# EasyEDA Pro project BCD_Source.epro

# Schematic Schematic1
Board Name: Board1; Create Date: 2026-05-20; Page Name: P1; Project Name: pcbwatch; Schematic Name: Schematic1; Update Date: 2026-05-27; Company: EasyEDA.com; Page Size: A4; Version: V1.0
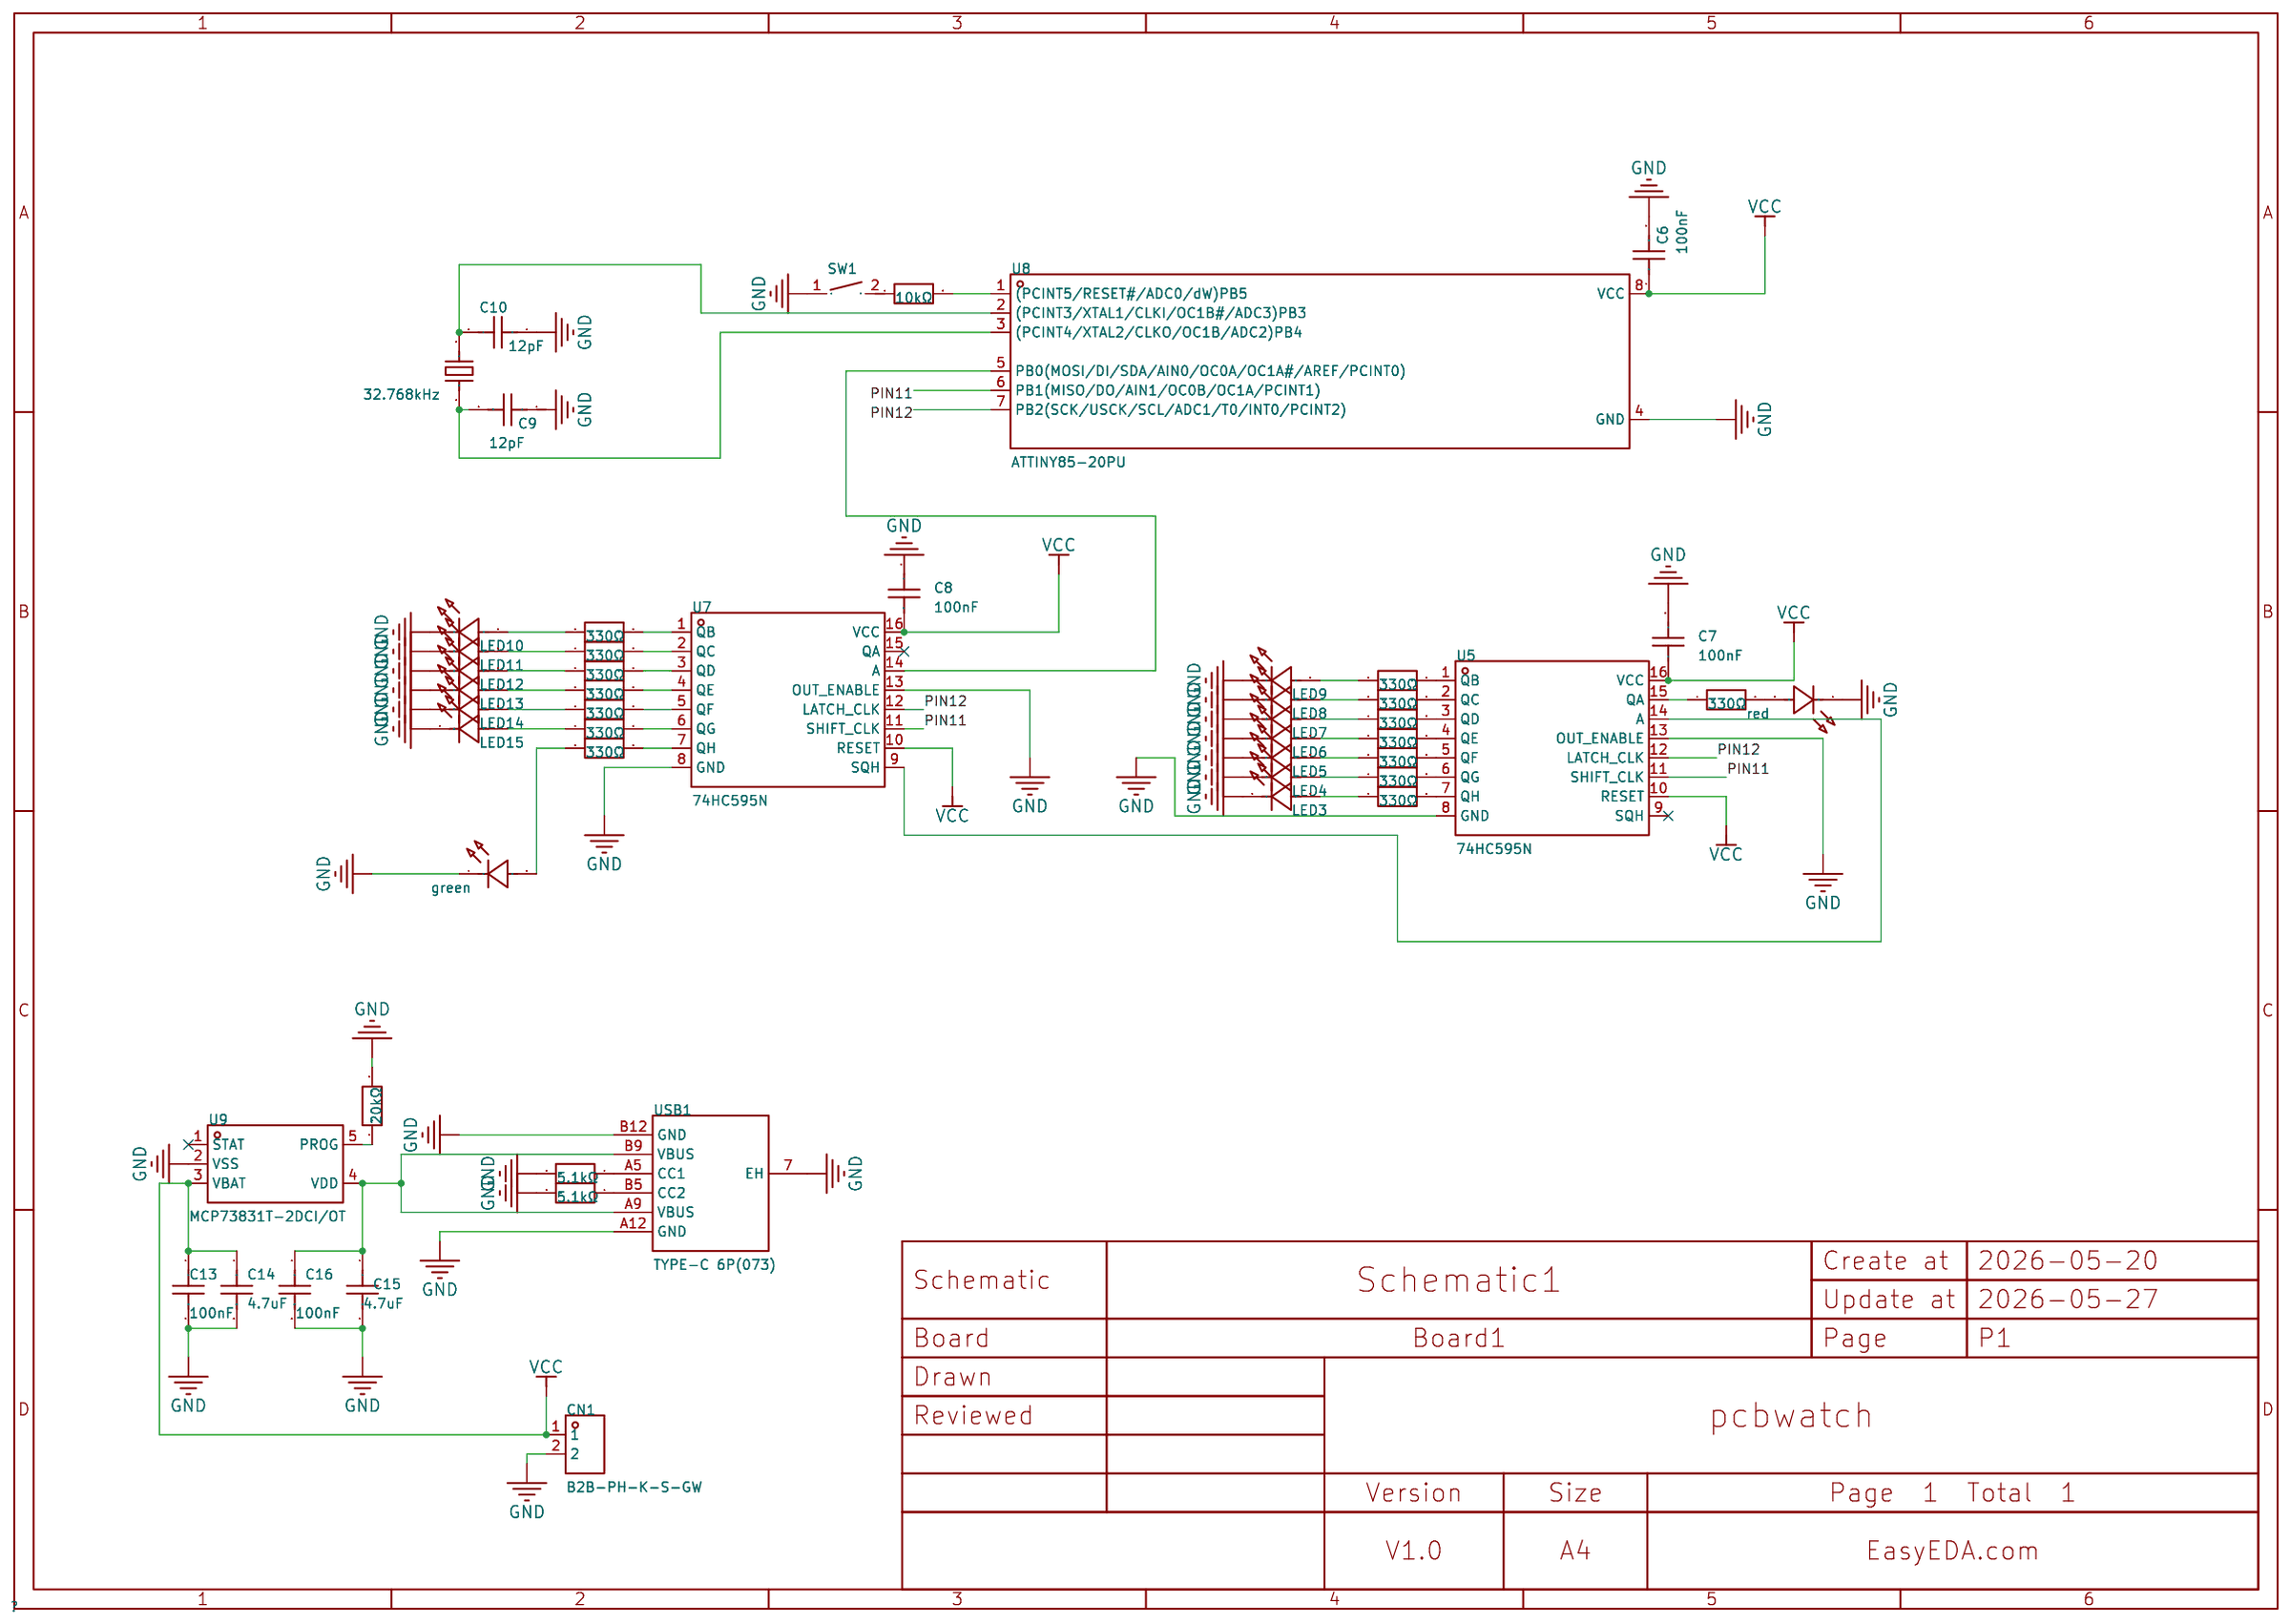
[diagram p0: schematic sheet]

## Parts
C6  100nF  [CAP-TH_L5.8-W2.4-P2.54-D0.6]
C7  100nF  [CAP-TH_L5.8-W2.4-P2.54-D0.6]
C8  100nF  [CAP-TH_L5.8-W2.4-P2.54-D0.6]
C9  12pF  [CAP-TH_L5.8-W2.4-P2.54-D0.6]
C10  12pF  [CAP-TH_L5.8-W2.4-P2.54-D0.6]
C13  100nF  [CAP-TH_L5.8-W2.4-P2.54-D0.6]
C14  4.7uF  [CAP-TH_L5.8-W2.4-P2.54-D0.6]
C15  4.7uF  [CAP-TH_L5.8-W2.4-P2.54-D0.6]
C16  100nF  [CAP-TH_L5.8-W2.4-P2.54-D0.6]
CN1  B2B-PH-K-S-GW  [CONN-TH_B2B-PH-K-S]
green  TJ-S2012EX8T5ALC2R-A5  [LED0805-RD]
LED3  TJ-S2012EX8T5ALC2R-A5  [LED0805-RD]
LED4  TJ-S2012EX8T5ALC2R-A5  [LED0805-RD]
LED5  TJ-S2012EX8T5ALC2R-A5  [LED0805-RD]
LED6  TJ-S2012EX8T5ALC2R-A5  [LED0805-RD]
LED7  TJ-S2012EX8T5ALC2R-A5  [LED0805-RD]
LED8  TJ-S2012EX8T5ALC2R-A5  [LED0805-RD]
LED9  TJ-S2012EX8T5ALC2R-A5  [LED0805-RD]
LED10  TJ-S2012EX8T5ALC2R-A5  [LED0805-RD]
LED11  TJ-S2012EX8T5ALC2R-A5  [LED0805-RD]
LED12  TJ-S2012EX8T5ALC2R-A5  [LED0805-RD]
LED13  TJ-S2012EX8T5ALC2R-A5  [LED0805-RD]
LED14  TJ-S2012EX8T5ALC2R-A5  [LED0805-RD]
LED15  TJ-S2012EX8T5ALC2R-A5  [LED0805-RD]
R20  330Ω  [RES-TH_BD2.3-L6.5-P10.50-D0.5]
R21  330Ω  [RES-TH_BD2.3-L6.5-P10.50-D0.5]
R22  330Ω  [RES-TH_BD2.3-L6.5-P10.50-D0.5]
R23  330Ω  [RES-TH_BD2.3-L6.5-P10.50-D0.5]
R24  330Ω  [RES-TH_BD2.3-L6.5-P10.50-D0.5]
R25  330Ω  [RES-TH_BD2.3-L6.5-P10.50-D0.5]
R26  330Ω  [RES-TH_BD2.3-L6.5-P10.50-D0.5]
R27  330Ω  [RES-TH_BD2.3-L6.5-P10.50-D0.5]
R28  330Ω  [RES-TH_BD2.3-L6.5-P10.50-D0.5]
R29  330Ω  [RES-TH_BD2.3-L6.5-P10.50-D0.5]
R30  330Ω  [RES-TH_BD2.3-L6.5-P10.50-D0.5]
R31  330Ω  [RES-TH_BD2.3-L6.5-P10.50-D0.5]
R32  330Ω  [RES-TH_BD2.3-L6.5-P10.50-D0.5]
R33  330Ω  [RES-TH_BD2.3-L6.5-P10.50-D0.5]
R34  330Ω  [RES-TH_BD2.3-L6.5-P10.50-D0.5]
R36  10kΩ  [RES-TH_BD2.3-L6.5-P10.50-D0.5]
R40  20kΩ  [RES-TH_BD2.3-L6.5-P10.50-D0.5]
R41  5.1kΩ  [RES-TH_BD2.3-L6.5-P10.50-D0.5]
R42  5.1kΩ  [RES-TH_BD2.3-L6.5-P10.50-D0.5]
red  TJ-S2012EX8T5ALC2R-A5  [LED0805-RD]
SW1  HX 3x4x2-2P-1.6N TACTILE SWITCH  [KEY-SMD_L4.0-W3.0-LS4.9-1]
U5  74HC595N  [DIP-16_L19.8-W6.5-P2.54-LS7.6-BL]
U7  74HC595N  [DIP-16_L19.8-W6.5-P2.54-LS7.6-BL]
U8  ATTINY85-20PU  [PDIP-8_L9.3-W6.4-P2.54-LS7.9-BL-1]
U9  MCP73831T-2DCI/OT  [SOT-23-5_L2.9-W1.6-P0.95-LS2.8-BL]
USB1  TYPE-C 6P(073)  [TYPE-C-SMD_TYPE-C-6P-073]
X1  32.768kHz  [OSC-TH_BD2.0-P0.70-D0.3]

## Library data of the parts
C6-C10 C13-C16 = CC1H104ZA1ED3F5P1100: Capacitance:100nF Tolerance:-20%~+80% Tolerance:-20%~+80% Voltage Rating:50V Pin Spacing:2.54mm Temperature Coefficient:Y5V Diameter:5.8mm Body Thickness:2.4mm; LCSC Part Name: 100nF -20%~+80% 50V; Supplier Part: C2832506; Manufacturer: Dersonic(德尔创); Supplier Footprint: 插件,P=2.54mm; JLCPCB Part Class: Extended Part; Datasheet: https://item.szlcsc.com/datasheet/CC1H104ZA1ED3F5P1100/2990644.html; Supplier: LCSC; Tolerance: -20%~+80%; Voltage Rating: 50V; Pin Spacing: 2.54mm; Temperature Coefficient: Y5V; Diameter: 5.8mm; Body Thickness: 2.4mm
CN1 = B2B-PH-K-S-GW: Pins Structure:1x2P Pitch:2mm Mounting Type:Through Hole Reference Series:PH Number of Pins:2P Number of Rows:1 Number of PINs Per Row:2 Row Spacing:- Current Rating:2A Contact Material:Brass Contact Plating:Tin Operating Temperature:-25℃~+85℃ Operating T; LCSC Part Name: 1x2P 间距:2mm 直插 系列:PH; Supplier Part: C5251182; Manufacturer: JST; Supplier Footprint: 插件,P=2mm; JLCPCB Part Class: Extended Part; Datasheet: https://item.szlcsc.com/datasheet/B2B-PH-K-S-GW/5967705.html; Supplier: LCSC; Pins Structure: 1x2P; Pitch: 2mm; Mounting Type: Through Hole; Reference Series: PH; Number of Pins: 2P; Number of Rows: 1; Number of PINs Per Row: 2; Current Rating: 2A; Contact Material: Brass; Contact Plating: Tin; Operating Temperature: -25℃~+85℃; Voltage Rating: 100V; Plastic Material: PA66; Flame Retardant Rating: UL94V-0; Supplementary Features: K Pin; Color: White; Z-Height of the Board: 6mm; X-Length of Bottom Edge on Board (Spacing Line): 5.9mm; Y-Width of Bottom Edge on Board: 4.5mm
green LED3-LED15 red = TJ-S2012EX8T5ALC2R-A5: Lamp Holder Type:2mm x 1.25mm square LED Illumination Color:Red Voltage - Forward(Vf):1.8V~2.4V Voltage - Forward(Vf):1.8V~2.4V Power(Watts):48mW Forward Current:20mA Wavelength - Dominant:620nm~630nm Wavelength - Dominant:620nm~630nm Peak Wavelength:631n; LCSC Part Name: SMD0805灯珠红光; Supplier Part: C48689647; Manufacturer: TOGIALED(统佳); Supplier Footprint: 0805; JLCPCB Part Class: Extended Part; Datasheet: https://item.szlcsc.com/datasheet/TJ-S2012EX8T5ALC2R-A5/50980865.html; Supplier: LCSC; Lamp Holder Type: 2mm x 1.25mm square LED; Illumination Color: Red; Voltage - Forward(Vf): 1.8V~2.4V; Power(Watts): 48mW; Forward Current: 20mA; Wavelength - Dominant: 620nm~630nm; Peak Wavelength: 631nm; Diode Configuration: Discrete Diode; Lens Color: Water Clear; Luminous Intensity: 200mcd; Viewing Angle: 120°; Operating Temperature: -40℃~+80℃
R20-R34 R36 R40-R42 = MF1/4W-1KΩ±1%T52: Type:Metal Film Resistors Resistance: Tolerance:±1% Tolerance:±1% Power(Watts):250mW Temperature Coefficient:±200ppm/℃ Temperature Coefficient:±200ppm/℃; LCSC Part Name: 金属膜电阻 1kΩ ±1% 250mW; Supplier Part: C713997; Manufacturer: 华星机电; Supplier Footprint: 插件,D2.3xL6.5mm; JLCPCB Part Class: Extended Part; Datasheet: https://atta.szlcsc.com/upload/public/pdf/source/20200731/C713882_AE8EB1102749D7E4FB4FB13DC898C429.pdf; Supplier: LCSC; Type: Metal Film Resistors; Tolerance: ±1%; Power(Watts): 250mW; Temperature Coefficient: ±200ppm/℃
SW1 = HX 3x4x2-2P-1.6N TACTILE SWITCH: Circuit:SPST Actuator Style:Round Button Operating Force:1.6N Mounting Type:Surface Mount,Vertical Length:4mm Width:3mm Switch Height:2mm with Bracket:Without Bracket Contact Current:50mA Voltage Rating:12V Actuator/Cap Color:Black With Lamp:No IP Rating:; LCSC Part Name: 4*3*2mm 立贴 轻触开关; Supplier Part: C49234124; Manufacturer: hanxia(韩下); Supplier Footprint: SMD; JLCPCB Part Class: Extended Part; Datasheet: https://item.szlcsc.com/datasheet/HX%25203x4x2-2P-1.6N%2520TACTILE%2520SWITCH/51650185.html; Supplier: LCSC; Circuit: SPST; Actuator Style: Round Button; Operating Force: 1.6N; Mounting Type: Surface Mount,Vertical; Length: 4mm; Width: 3mm; Switch Height: 2mm; with Bracket: Without Bracket; Contact Current: 50mA; Voltage Rating: 12V; Actuator/Cap Color: Black; With Lamp: No; Termination Style: SMD(SMT) Tab; Life: 100,000 Cycles
U5 U7 = 74HC595N: Function:Serial-to-Serial or Parallel Voltage - Supply:2V~6V Voltage - Supply:2V~6V Clock Frequency:28MHz Number of Elements:1 Number of Bits per Element:8 Output Type:Tri-State Series:74HC Operating Temperature:-55℃~+125℃ Operating Temperature:-55℃~+125℃; LCSC Part Name: 停产 74HC595N; Supplier Part: C669328; Manufacturer: HTC; Supplier Footprint: DIP-16; JLCPCB Part Class: Extended Part; Datasheet: https://item.szlcsc.com/datasheet/74HC595N/699730.html; Supplier: LCSC; Function: Serial-to-Serial or Parallel; Voltage - Supply: 2V~6V; Clock Frequency: 28MHz; Number of Elements: 1; Number of Bits per Element: 8; Output Type: Tri-State; Series: 74HC; Operating Temperature: -55℃~+125℃
U8 = ATTINY85-20PU: CPU Core:AVR CPU Maximum Speed:20MHz Core Size:8 Bit Program Storage Size:8KB Program Memory Type:FLASH RAM Size:512Byte EEPROM:512Byte Number of I/O:6 ADC (Bit):10bit Oscillator Type:Built-in Voltage - Supply:2.7V~5.5V Voltage - Supply:2.7V~5.5V Operatin; Supplier Part: C965497; Manufacturer: MICROCHIP(美国微芯); Supplier Footprint: PDIP-8; JLCPCB Part Class: Extended Part; Datasheet: https://item.szlcsc.com/datasheet/ATTINY85-20PU/1052792.html; Supplier: LCSC; CPU Core: AVR; CPU Maximum Speed: 20MHz; Core Size: 8 Bit; Program Storage Size: 8KB; Program Memory Type: FLASH; RAM Size: 512Byte; EEPROM: 512Byte; Number of I/O: 6; ADC (Bit): 10bit; Oscillator Type: Built-in; Voltage - Supply: 2.7V~5.5V; Operating Temperature: -40℃~+85℃
U9 = MCP73831T-2DCI/OT: The Chip Type:Charging IC Voltage - Supply:3.75V~6V Voltage - Supply:3.75V~6V Charge Current - Max:550mA Charging Saturation Voltage:4.2V End-Off Voltage:- Type of Battery:Lithium Battery Number of Cells:1 Number of Cells:1 Operating Temperature:-40℃~+85℃; LCSC Part Name: 单节全集成锂离子/锂聚合物充电管理控制器; Supplier Part: C625597; Manufacturer: MICROCHIP(美国微芯); Supplier Footprint: SOT-23-5; JLCPCB Part Class: Extended Part; Datasheet: https://item.szlcsc.com/datasheet/MCP73831T-2DCI%252FOT/655504.html; Supplier: LCSC; The Chip Type: Charging IC; Voltage - Supply: 3.75V~6V; Charge Current - Max: 550mA; Charging Saturation Voltage: 4.2V; Type of Battery: Lithium Battery; Number of Cells: 1; Operating Temperature: -40℃~+85℃; Battery Temperature Detection: Not supported; Supply Current (Iq): 53uA
USB1 = TYPE-C 6P(073): Connector Type:Type-C Protocol Standard:- Gender:Female Mounting Type:Surface Mount, Right Angle Number of Contacts:6P Number of Ports:1 Current Rating-Power:3A Voltage Rating:5V Connect-Disconnect Life:10,000 Cycles Supplementary Features:- Center Height; LCSC Part Name: 6P卧贴母座; Supplier Part: C668623; Manufacturer: SHOU HAN(首韩); Supplier Footprint: SMD; JLCPCB Part Class: Extended Part; Datasheet: https://item.szlcsc.com/datasheet/TYPE-C%25206P(073)/698566.html; Supplier: LCSC; Connector Type: Type-C; Gender: Female; Mounting Type: Surface Mount, Right Angle; Number of Contacts: 6P; Number of Ports: 1; Current Rating-Power: 3A; Voltage Rating: 5V; Connect-Disconnect Life: 10,000 Cycles; Detection color: Black; Operating Temperature: -25℃~+85℃
X1 = TAXD32768K2BGBBZT2S: Type:Through Hole Crystal Oscillator Frequency:32.768kHz Normal temperature Frequency Tolerance:±10ppm Normal temperature Frequency Tolerance:±10ppm Load Capacitance:12.5pF Frequency Stability:±20ppm Frequency Stability:±20ppm Equivalent Series Resistance; LCSC Part Name: 32.768kHz ±10ppm 12.5pF; Supplier Part: C511702; Manufacturer: YJX(雅晶鑫); Supplier Footprint: DT-26; JLCPCB Part Class: Extended Part; Datasheet: https://item.szlcsc.com/datasheet/TAXD32768K2BGBBZT2S/526449.html; Supplier: LCSC; Type: Through Hole Crystal Oscillator; Normal temperature Frequency Tolerance: ±10ppm; Load Capacitance: 12.5pF; Frequency Stability: ±20ppm; Equivalent Series Resistance(ESR): 40kΩ; Operating Temperature: -20℃~+70℃

## Nets
GND: C6.2 C7.2 C8.1 C9.1 C10.1 C13.2 C14.2 C15.2 C16.2 CN1.2 green.1(C) LED3.1(C) LED4.1(C) LED5.1(C) LED6.1(C) LED7.1(C) LED8.1(C) LED9.1(C) LED10.1(C) LED11.1(C) LED12.1(C) LED13.1(C) LED14.1(C) LED15.1(C) R40.2 R41.2 R42.2 red.1(C) SW1.1 U5.8(GND) U5.13(OUT_ENABLE) U7.8(GND) U7.13(OUT_ENABLE) U8.4(GND) U9.2(VSS) USB1.7(EH) USB1.A12(GND) USB1.B12(GND)
VCC: C6.1 C7.1 C8.2 C13.1 C14.1 CN1.1 U5.10(RESET) U5.16(VCC) U7.10(RESET) U7.16(VCC) U8.8(VCC) U9.3(VBAT)
PIN11: U5.11(SHIFT_CLK) U7.11(SHIFT_CLK) U8.6(PB1(MISO/DO/AIN1/OC0B/OC1A/PCINT1))
PIN12: U5.12(LATCH_CLK) U7.12(LATCH_CLK) U8.7(PB2(SCK/USCK/SCL/ADC1/T0/INT0/PCINT2))
$1N1454: U7.14(A) U8.5(PB0(MOSI/DI/SDA/AIN0/OC0A/OC1A#/AREF/PCINT0))
$1N1740: U5.14(A) U7.9(SQH)
$1N15518: R40.1 U9.5(PROG)
Net-(C9-2): C9.2 U8.3((PCINT4/XTAL2/CLKO/OC1B/ADC2)PB4) X1.1
Net-(C10-2): C10.2 U8.2((PCINT3/XTAL1/CLKI/OC1B#/ADC3)PB3) X1.2
Net-(C15-1): C15.1 C16.1 U9.4(VDD) USB1.A9(VBUS) USB1.B9(VBUS)
Net-(green-2): green.2(A) R26.1
Net-(LED3-2): LED3.2(A) R33.1
Net-(LED4-2): LED4.2(A) R32.1
Net-(LED5-2): LED5.2(A) R31.1
Net-(LED6-2): LED6.2(A) R30.1
Net-(LED7-2): LED7.2(A) R29.1
Net-(LED8-2): LED8.2(A) R28.1
Net-(LED9-2): LED9.2(A) R27.1
Net-(LED10-2): LED10.2(A) R20.1
Net-(LED11-2): LED11.2(A) R21.1
Net-(LED12-2): LED12.2(A) R22.1
Net-(LED13-2): LED13.2(A) R23.1
Net-(LED14-2): LED14.2(A) R24.1
Net-(LED15-2): LED15.2(A) R25.1
Net-(R20-2): R20.2 U7.1(QB)
Net-(R21-2): R21.2 U7.2(QC)
Net-(R22-2): R22.2 U7.3(QD)
Net-(R23-2): R23.2 U7.4(QE)
Net-(R24-2): R24.2 U7.5(QF)
Net-(R25-2): R25.2 U7.6(QG)
Net-(R26-2): R26.2 U7.7(QH)
Net-(R27-2): R27.2 U5.1(QB)
Net-(R28-2): R28.2 U5.2(QC)
Net-(R29-2): R29.2 U5.3(QD)
Net-(R30-2): R30.2 U5.4(QE)
Net-(R31-2): R31.2 U5.5(QF)
Net-(R32-2): R32.2 U5.6(QG)
Net-(R33-2): R33.2 U5.7(QH)
Net-(R34-1): R34.1 U5.15(QA)
Net-(R34-2): R34.2 red.2(A)
Net-(R36-1): R36.1 SW1.2
Net-(R36-2): R36.2 U8.1((PCINT5/RESET#/ADC0/dW)PB5)
Net-(R41-1): R41.1 USB1.A5(CC1)
Net-(R42-1): R42.1 USB1.B5(CC2)

Not connected (* = marked no-connect by the designer): U5 9(SQH)*; U7 15(QA)*; U9 1(STAT)*

# Board PCB1
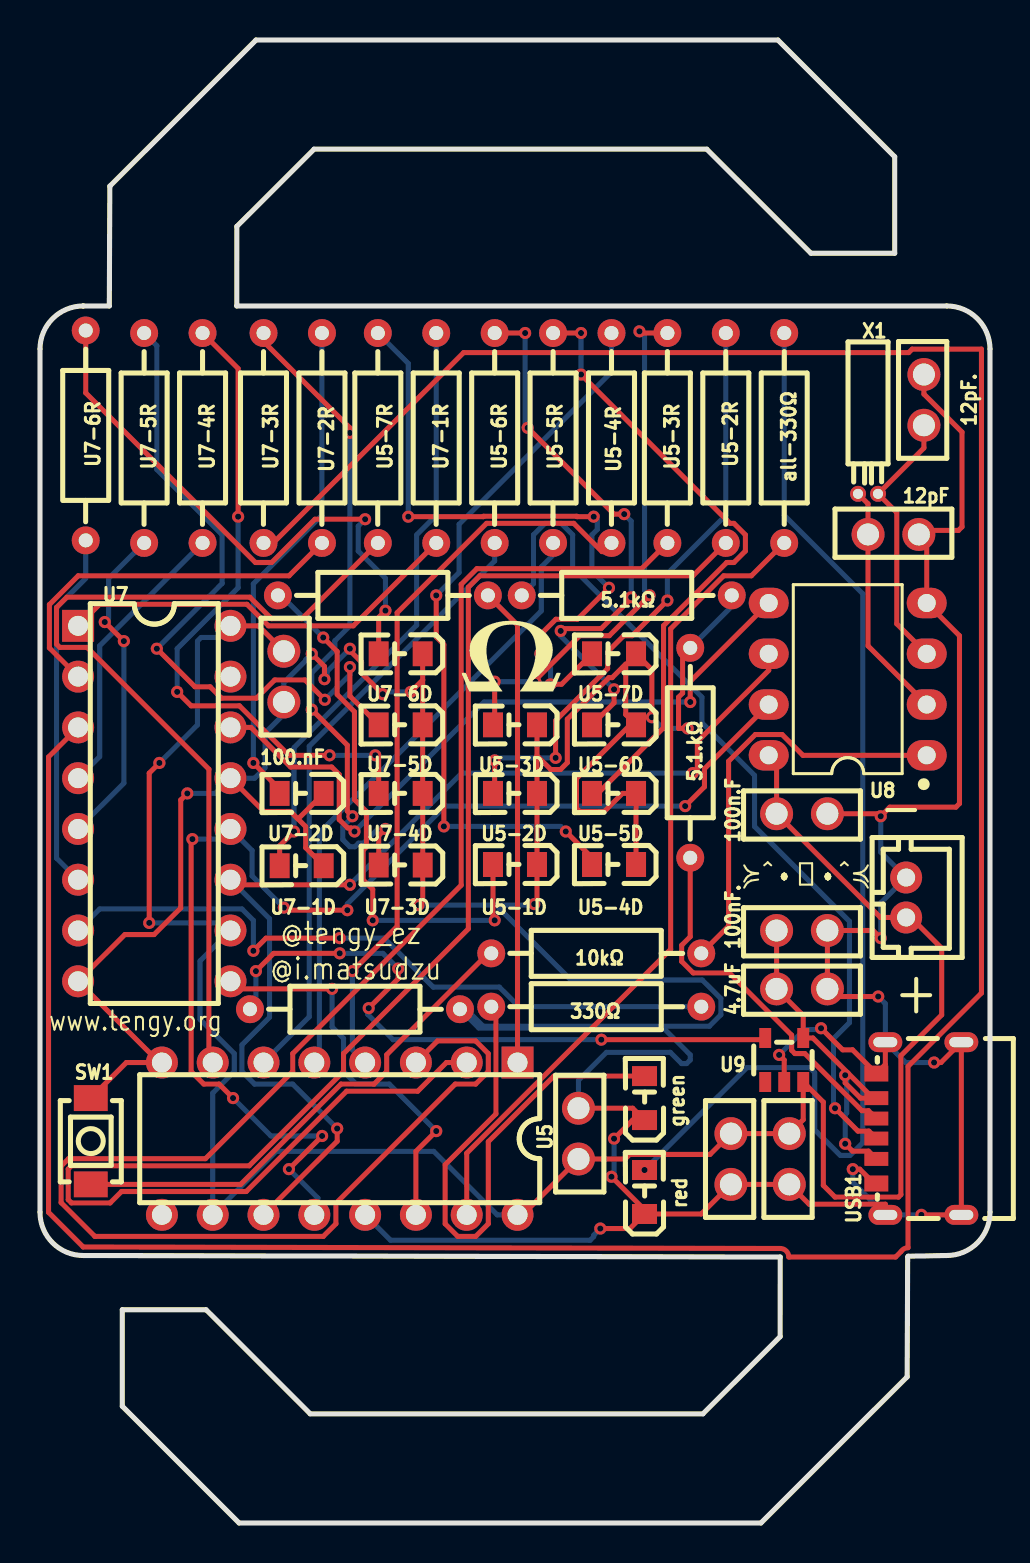
[diagram p1: board, top side]
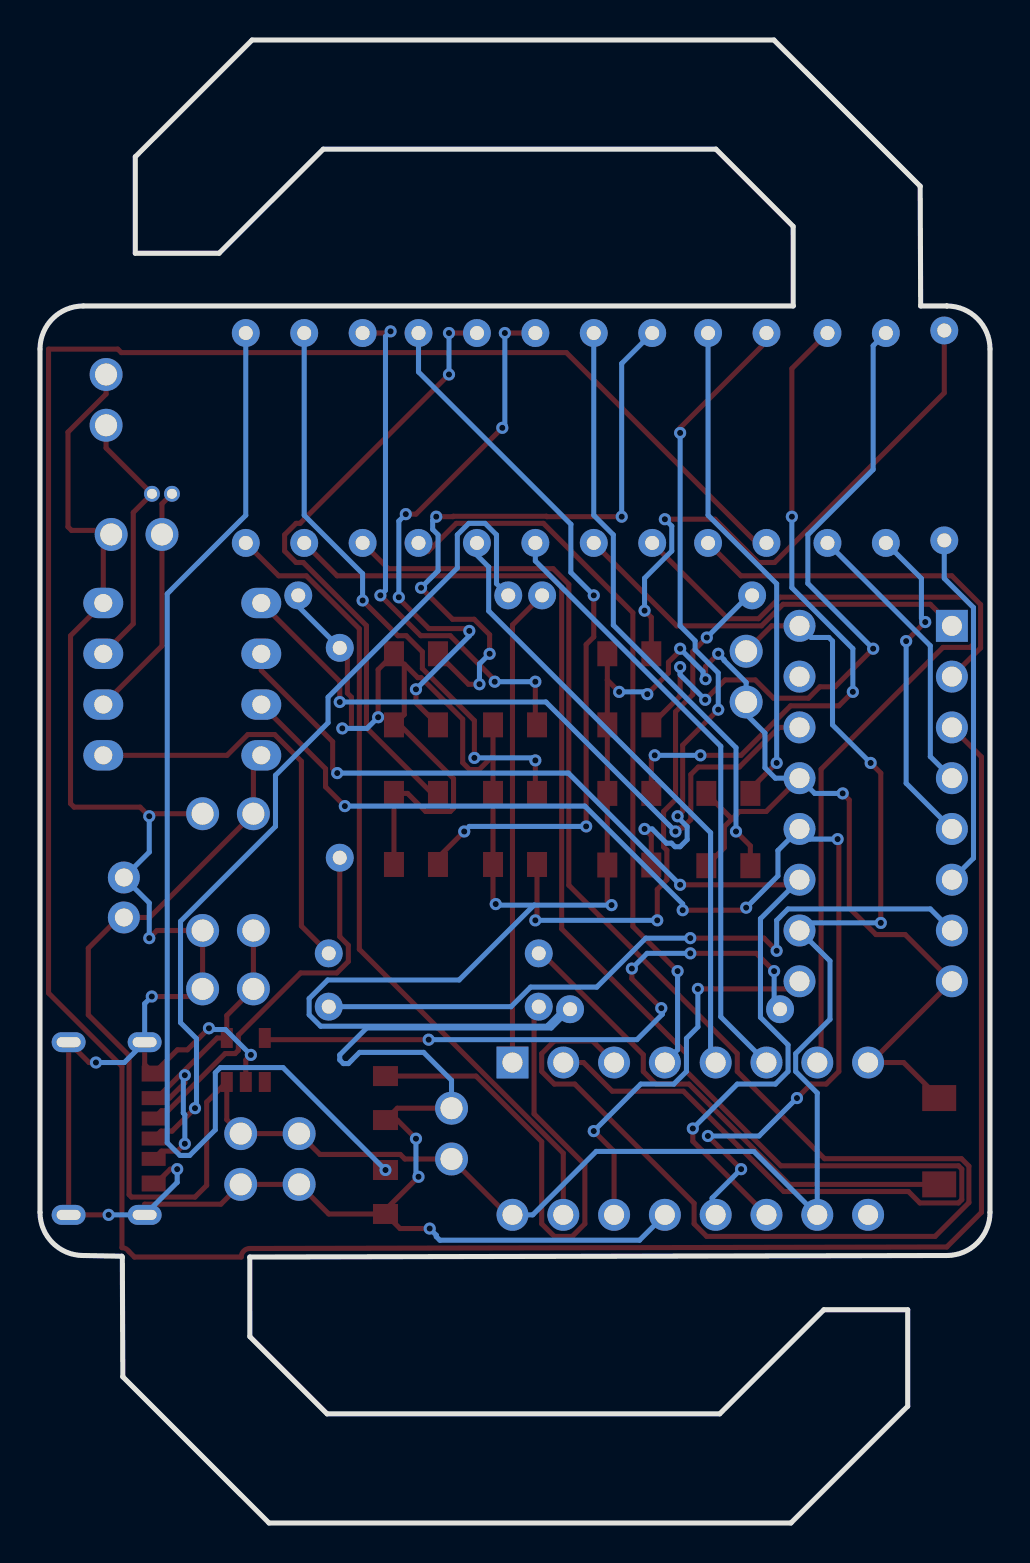
[diagram p2: board, bottom side, seen from below]

Outline 47.5 x 74.19 mm; copper layers: Top Layer, Bottom Layer. Coordinates in mm from the lower left corner of the outline.
Outline path: 0,58.72 arc(0.63,60.25) 2.16,60.88 2.15,60.88 3.47,60.88 3.49,66.87 10.8,74.19 36.89,74.19 42.73,68.35 42.73,63.52 38.54,63.52 33.34,68.73 13.71,68.73 9.84,64.86 9.84,60.88 45.34,60.88 arc(46.87,60.25) 47.5,58.72 47.5,15.54 arc(46.87,14.01) 45.34,13.38 43.41,13.35 43.38,13.31 43.36,7.31 36.05,0 9.96,0 4.11,5.84 4.11,10.67 8.31,10.67 13.51,5.46 33.14,5.46 37.01,9.33 37.01,13.31 2.16,13.38 arc(0.63,14.01) 0,15.54 0,58.72
Stack: Top Layer 0.035mm / Dielectric1 1.51mm FR4 er 4.5 / Bottom Layer 0.035mm

## Design rules (mm)
spacing copperThickness1oz (default): track to track 0.102, other pairs 0.152 to 0.3
spacing copperThickness2oz: track to track 0.203, other pairs 0.152 to 0.3
spacing Plane_innerPlane: track to track 0.102, other pairs 0.152 to 0.3
spacing Copper_copperRegion: track to track 0.102, other pairs 0.152 to 0.3
track width copperThickness1oz (default): min 0.127, default 0.254, max 2.54
track width copperThickness2oz: min 0.203, default 0.254, max 2.54
differential pair differentialPair (default): width min 0.127, default 0.254, max 2.54; gap min 0.152, default 0.152
net GND uses copperRegion

## Placement (name value [footprint] x y rotation side)
3A  4.7uF  [CAP-TH_L5.8-W2.4-P2.54-D0.6]  37.47 18.21 270 top
3B  100nF  [CAP-TH_L5.8-W2.4-P2.54-D0.6]  34.54 18.21 270 top
4.7uF  4.7uF  [CAP-TH_L5.8-W2.4-P2.54-D0.6]  38.1 26.72 0 top
5.1.kΩ  5.1kΩ  [RES-TH_BD2.3-L6.5-P10.50-D0.5]  32.51 38.53 90 top
5.1kΩ  5.1kΩ  [RES-TH_BD2.3-L6.5-P10.50-D0.5]  29.34 46.4 0 top
10kΩ  10kΩ  [RES-TH_BD2.3-L6.5-P10.50-D0.5]  27.81 28.5 0 top
12pF  12pF  [CAP-TH_L5.8-W2.4-P2.54-D0.6]  42.67 49.45 180 top
12pF.  12pF  [CAP-TH_L5.8-W2.4-P2.54-D0.6]  44.2 56.18 270 top
100.nF  100nF  [CAP-TH_L5.8-W2.4-P2.54-D0.6]  12.19 42.34 90 top
100n.F  100nF  [CAP-TH_L5.8-W2.4-P2.54-D0.6]  38.1 35.48 0 top
100nF.  100nF  [CAP-TH_L5.8-W2.4-P2.54-D0.6]  38.1 29.64 0 top
330Ω  330Ω  [RES-TH_BD2.3-L6.5-P10.50-D0.5]  27.81 25.83 0 top
all-330Ω  330Ω  [RES-TH_BD2.3-L6.5-P10.50-D0.5]  37.21 54.28 90 top
C7  100nF  [CAP-TH_L5.8-W2.4-P2.54-D0.6]  26.92 19.48 90 top
CN1  B2B-PH-K-S-GW  [CONN-TH_B2B-PH-K-S]  43.31 31.29 270 top
green  TJ-S2012EX8T5ALC2R-A5  [LED0805-RD]  30.23 21.26 90 top
R40  20kΩ  [RES-TH_BD2.3-L6.5-P10.50-D0.5]  15.75 25.7 0 top
red  TJ-S2012EX8T5ALC2R-A5  [LED0805-RD]  30.23 16.56 90 top
SW1  HX 3x4x2-2P-1.6N TACTILE SWITCH  [KEY-SMD_L4.0-W3.0-LS4.9-1]  2.54 19.1 270 top
U5  74HC595N  [DIP-16_L19.8-W6.5-P2.54-LS7.6-BL]  14.99 19.23 180 top
U5-1D  TJ-S2012EX8T5ALC2R-A5  [LED0805-RD]  23.75 32.94 180 top
U5-1R  330Ω  [RES-TH_BD2.3-L6.5-P10.50-D0.5]  17.14 46.4 0 top
U5-2D  TJ-S2012EX8T5ALC2R-A5  [LED0805-RD]  23.75 36.5 180 top
U5-2R  330Ω  [RES-TH_BD2.3-L6.5-P10.50-D0.5]  34.29 54.28 270 top
U5-3D  TJ-S2012EX8T5ALC2R-A5  [LED0805-RD]  23.75 39.93 180 top
U5-3R  330Ω  [RES-TH_BD2.3-L6.5-P10.50-D0.5]  31.37 54.28 270 top
U5-4D  TJ-S2012EX8T5ALC2R-A5  [LED0805-RD]  28.7 32.94 180 top
U5-4R  330Ω  [RES-TH_BD2.3-L6.5-P10.50-D0.5]  28.57 54.28 270 top
U5-5D  TJ-S2012EX8T5ALC2R-A5  [LED0805-RD]  28.7 36.5 180 top
U5-5R  330Ω  [RES-TH_BD2.3-L6.5-P10.50-D0.5]  25.65 54.28 270 top
U5-6D  TJ-S2012EX8T5ALC2R-A5  [LED0805-RD]  28.7 39.93 180 top
U5-6R  330Ω  [RES-TH_BD2.3-L6.5-P10.50-D0.5]  22.73 54.28 270 top
U5-7D  TJ-S2012EX8T5ALC2R-A5  [LED0805-RD]  28.7 43.48 180 top
U5-7R  330Ω  [RES-TH_BD2.3-L6.5-P10.50-D0.5]  16.89 54.28 270 top
U7  74HC595N  [DIP-16_L19.8-W6.5-P2.54-LS7.6-BL]  5.72 35.99 270 top
U7-1D  TJ-S2012EX8T5ALC2R-A5  [LED0805-RD]  13.08 32.88 180 top
U7-1R  330Ω  [RES-TH_BD2.3-L6.5-P10.50-D0.5]  19.81 54.28 270 top
U7-2D  TJ-S2012EX8T5ALC2R-A5  [LED0805-RD]  13.08 36.5 180 top
U7-2R  330Ω  [RES-TH_BD2.3-L6.5-P10.50-D0.5]  14.1 54.28 270 top
U7-3D  TJ-S2012EX8T5ALC2R-A5  [LED0805-RD]  18.04 32.92 180 top
U7-3R  330Ω  [RES-TH_BD2.3-L6.5-P10.50-D0.5]  11.18 54.28 270 top
U7-4D  TJ-S2012EX8T5ALC2R-A5  [LED0805-RD]  18.03 36.5 180 top
U7-4R  330Ω  [RES-TH_BD2.3-L6.5-P10.50-D0.5]  8.13 54.28 270 top
U7-5D  TJ-S2012EX8T5ALC2R-A5  [LED0805-RD]  18.03 39.93 180 top
U7-5R  330Ω  [RES-TH_BD2.3-L6.5-P10.50-D0.5]  5.21 54.28 270 top
U7-6D  TJ-S2012EX8T5ALC2R-A5  [LED0805-RD]  18.03 43.48 180 top
U7-6R  330Ω  [RES-TH_BD2.3-L6.5-P10.50-D0.5]  2.29 54.41 270 top
U8  ATTINY85-20PU  [PDIP-8_L9.3-W6.4-P2.54-LS7.9-BL-1]  40.39 42.21 90 top
U9  MCP73831T-2DCI/OT  [SOT-23-5_L2.9-W1.6-P0.95-LS2.8-BL]  37.21 23.16 0 top
USB1  TYPE-C 6P(073)  [TYPE-C-SMD_TYPE-C-6P-073]  43.94 19.73 90 top
X1  32.768kHz  [OSC-TH_BD2.0-P0.70-D0.3]  41.4 51.48 270 top

## Footprints (pads in the part's own frame, mm; a bottom-side part is the same pattern mirrored in y, then rotated)
CAP-TH_L5.8-W2.4-P2.54-D0.6
  round 1.65 hole 1.1: 1(-1.27,0) 2(1.27,0)
CONN-TH_B2B-PH-K-S
  round 1.6 hole 0.9: 1(1,0) 2(-1,0)
DIP-16_L19.8-W6.5-P2.54-LS7.6-BL
  rect 1.6x1.6 hole 1: 1(-8.89,-3.81)
  round 1.6 hole 1: 2(-6.35,-3.81) 3(-3.81,-3.81) 4(-1.27,-3.81) 5(1.27,-3.81) 6(3.81,-3.81) 7(6.35,-3.81) 8(8.89,-3.81) 9(8.89,3.81) 10(6.35,3.81) 11(3.81,3.81) 12(1.27,3.81) 13(-1.27,3.81) 14(-3.81,3.81) 15(-6.35,3.81) 16(-8.89,3.81)
KEY-SMD_L4.0-W3.0-LS4.9-1
  rect 1.3x1.7 smd: 1(-2.159,0) 2(2.159,0)
LED0805-RD
  rect 1x1.25 smd: 1(-1.1,0) 2(1.1,0)
OSC-TH_BD2.0-P0.70-D0.3
  round 0.8 hole 0.5: 1(0,0.5) 2(0,-0.5)
PDIP-8_L9.3-W6.4-P2.54-LS7.9-BL-1
  oval 1.524x2 hole 0.9: 1(-3.81,-3.95) 2(-1.27,-3.95) 3(1.27,-3.95) 4(3.81,-3.95) 5(3.81,3.95) 6(1.27,3.95) 7(-1.27,3.95) 8(-3.81,3.95)
RES-TH_BD2.3-L6.5-P10.50-D0.5
  round 1.4 hole 0.7: 1(-5.25,0) 2(5.25,0)
SOT-23-5_L2.9-W1.6-P0.95-LS2.8-BL
  rect 0.6x1 smd: 1(-0.95,-1.1) 2(0,-1.1) 3(0.95,-1.1) 4(0.95,1.1) 5(-0.95,1.1)
TYPE-C-SMD_TYPE-C-6P-073
  oval 1x1.7 hole 0.5x1.2: 7(-4.32,1.675) 7(-4.32,-2.125) 7(4.32,1.675) 7(4.32,-2.125)
  rect 0.7x1.2 smd: A5(-0.5,2.125) A9(1.52,2.125) B5(0.5,2.125) B9(-1.52,2.125)
  rect 0.8x1.2 smd: A12(2.75,2.125) B12(-2.75,2.125)

## Nets
GND: 3A.2 3B.2 4.7uF.2 5.1.kΩ.2 5.1kΩ.2 12pF.1 12pF..1 100.nF.1 100n.F.2 100nF..2 C7.2 CN1.2 green.1 R40.2 red.1 SW1.1 U5.8 U5.13 U5-1D.1 U5-2D.1 U5-3D.1 U5-4D.1 U5-5D.1 U5-6D.1 U5-7D.1 U7.8 U7.13 U7-1D.1 U7-2D.1 U7-3D.1 U7-4D.1 U7-5D.1 U7-6D.1 U8.4 U9.2 USB1.7 USB1.A12 USB1.B12
VCC: 3A.1 3B.1 100.nF.2 100n.F.1 C7.1 CN1.1 U5.10 U5.16 U7.10 U7.16 U8.8 U9.3
PIN11: U5.11 U7.11 U8.6
PIN12: U5.12 U7.12 U8.7
$1N1454: U7.14 U8.5
$1N1740: U5.14 U7.9
$1N3175: U5-5D.2 U5-5R.1
$1N3221: U5-4D.2 U5-4R.1
$1N3267: U5-3D.2 U5-3R.1
$1N3313: U5-2D.2 U5-2R.1
$1N3359: U5-1D.2 U5-1R.1
$1N7289: U7-1D.2 U7-1R.1
$1N7335: U7-2D.2 U7-2R.1
$1N7381: U7-3D.2 U7-3R.1
$1N7427: U7-4D.2 U7-4R.1
$1N7473: U7-5D.2 U7-5R.1
$1N7519: U7-6D.2 U7-6R.1
$1N7565: 330Ω.1 green.2
$1N8990: U5-6D.2 U5-6R.1
$1N8994: U5-7D.2 U5-7R.1
$1N10884: all-330Ω.1 U5.15
$1N10886: all-330Ω.2 red.2
$1N10962: 10kΩ.2 U8.1
$1N10964: 10kΩ.1 SW1.2
$1N11563: U5.1 U5-1R.2
$1N11565: U5.2 U5-2R.2
$1N11567: U5.3 U5-3R.2
$1N11569: U5.4 U5-4R.2
$1N11571: U5.5 U5-5R.2
$1N11573: U5.6 U5-6R.2
$1N11575: U5.7 U5-7R.2
$1N11659: U7.1 U7-1R.2
$1N11661: U7.2 U7-2R.2
$1N11663: U7.3 U7-3R.2
$1N11665: U7.4 U7-4R.2
$1N11667: U7.5 U7-5R.2
$1N11669: U7.6 U7-6R.2
$1N11671: 330Ω.2 U7.7
$1N11673: U7.15
$1N13466: 12pF.2 U8.2 X1.2
$1N13478: 12pF..2 U8.3 X1.1
$1N15286: 4.7uF.1 100nF..1 U9.4 USB1.A9 USB1.B9
$1N15518: R40.1 U9.5
$1N16011: 5.1.kΩ.1 USB1.B5
$1N16013: 5.1kΩ.1 USB1.A5

Pads without a net: U5 9; U9 1

## Via types
v1: diameter 0.61, hole 0.305, Top Layer to Bottom Layer, 92 vias

## Routing (per net, layer and track width the routed paths; a pad name or vN(x,y) marks a point on that pad's centre or on a via; arc(x,y) is an arc through that point)
GND: length 284.7
  Top Layer w0.254: U5-7D.1 30.59,42.69 v1(30.59,40.31) ; v1(28.02,14.73) 29.5,14.73 red.1 ; 24.85,38.38 U5-2D.1 U5-1D.1 24.85,31.1 v1(24.71,30.96) ; 24.85,38.38 U5-3D.1 ; 24.85,38.38 25.54,37.69 26.02,37.69 26.37,38.03 26.37,40.21 28.44,42.29 28.61,42.29 29.29,42.97 29.29,40.44 U5-6D.1 29.51,39.93 26.82,37.24 26.82,35.76 26.99,35.59 28.22,35.59 29.12,36.5 U5-5D.1 U5-4D.1 ; 5.97,23.04 4.32,23.04 SW1.1 ; 5.97,23.04 U7.8 4.24,29.44 5.7,29.44 7.04,30.77 7.04,36.17 v1(7.37,36.5) ; 5.97,23.04 6.1,23.04 ; USB1.7 42.27,22.93 USB1.A12 40.63,23.67 40.13,23.67 v1(39.05,24.75) ; v1(44.07,15.41) USB1.7 USB1.7 45.05,23.04 v1(44.7,23.04) ; v1(40.64,17.7) 40.98,17.7 41.7,16.98 USB1.B12 ; USB1.7 42.27,15.95 38.46,15.95 3A.2 3B.2 33.06,15.46 red.1 ; 19.13,42.17 v1(18.54,41.58) ; 19.13,42.17 U7-6D.1 ; 19.13,42.17 U7-5D.1 U7-4D.1 19.14,36.5 U7-3D.1 19.14,31.12 v1(18.92,30.91) ; 12pF..1 44.2,56.47 46.1,54.57 46.1,49.83 45.92,49.65 44.14,49.65 12pF.1 44.34,49.06 U8.4 45.97,44.39 45.97,35.99 45.79,35.81 42.49,35.81 v1(42.04,35.36) 41.91,35.48 100n.F.2 ; U7-2D.1 12.92,35.23 12.88,35.23 ; v1(13.59,43.48) 14.22,42.85 v1(14.22,42.21) ; v1(32.38,39.75) 31.93,39.75 31.93,41.31 32.13,41.52 32.13,43.4 5.1.kΩ.2 ; U9.2 37.21,23.16 v1(36.96,23.42) ; v1(17.13,41.46) 16.08,42.52 16.08,43.06 15.49,43.64 v1(15.49,43.74) ; v1(28.7,19.23) 29.63,20.16 green.1 29.63,20.75 C7.2 ; v1(28.57,17.32) 30.23,15.67 red.1 ; v1(41.91,26.34) 39.75,26.34 4.7uF.2 100nF..2 41.66,29.64 v1(42.04,29.26) ; 12.88,35.23 13.28,34.84 13.28,33.78 U7-1D.1 ; 12.88,35.23 12.53,35.59 11.19,35.59 U7.13
  Bottom Layer w0.254: v1(40.64,17.7) 40.64,17.04 USB1.7 v1(44.07,15.41) ; 22.8,30.91 v1(18.92,30.91) ; 22.8,30.91 26.54,27.17 33.11,27.17 34.04,26.24 34.04,25.42 33.47,24.85 22.16,24.85 21.31,25.7 R40.2 21.94,24.76 31.17,24.76 32.51,23.42 32.51,23.16 32.33,22.98 32.08,22.98 31.52,23.54 28.32,23.54 26.92,22.15 C7.2 ; 22.8,30.91 24.66,30.91 v1(24.71,30.96) ; U5.13 17.53,14.15 27.51,14.15 27.69,14.33 27.69,14.4 v1(28.02,14.73) ; v1(28.7,19.23) 28.7,17.45 v1(28.57,17.32) ; v1(30.59,40.31) 31.15,39.75 v1(32.38,39.75) ; v1(42.04,29.26) 42.04,31.02 CN1.2 42.04,33.56 v1(42.04,35.36) ; v1(15.49,43.74) 14.35,42.59 14.35,42.34 v1(14.22,42.21) ; v1(36.96,23.42) 38.23,24.69 38.99,24.69 v1(39.05,24.75) ; v1(18.54,41.58) 17.25,41.58 v1(17.13,41.46) ; 5.1kΩ.2 34.59,45.86 5.1.kΩ.2 ; v1(13.59,43.48) 13.3,43.19 13.3,43.15 12.19,42.05 100.nF.1 12.37,40.89 12.37,40.64 11.25,39.52 11.25,37.78 10.73,37.26 U7.13 8.76,36.5 v1(7.37,36.5) ; v1(44.7,23.04) 43.28,23.04 USB1.7 42.27,25.98 v1(41.91,26.34)
VCC: length 113.6
  Top Layer w0.254: U5.16 24.13,15.42 C7.1 29.26,18.21 29.49,18.44 33.5,18.44 3B.1 3A.1 38.16,20.18 U9.3 39.17,21.06 39.17,16.89 39.75,16.31 42.93,16.31 43.05,16.42 43.05,23.38 45.09,25.42 45.09,28.75 43.54,30.29 CN1.1 42.02,30.29 100n.F.1 36.83,38.01 U8.8 ; U7.16 10.92,44.88 100.nF.2 ; v1(5.46,30.02) 5.46,37.51 v1(5.97,38.02)
  Bottom Layer w0.254: U5.16 22.86,15.42 19.69,18.59 11.81,18.59 U5.10 8.64,21.51 9.72,22.59 9.72,23.48 8,25.2 8,28.12 U7.10 9.14,30.02 v1(5.46,30.02) ; v1(5.97,38.02) 7.87,39.93 7.87,44.12 8.05,44.3 8.94,44.3 U7.16
PIN11: length 55.8
  Top Layer w0.254: v1(15.49,31.93) 9.78,31.93 U7.11 ; v1(32.64,37.51) 32.87,37.74 32.87,39.08 36.44,42.65 U8.6 ; U5.11 14.86,19.1 v1(14.86,19.73)
  Bottom Layer w0.254: v1(32.64,37.51) 21.08,37.51 v1(15.49,31.93) ; v1(14.86,19.73) 12.64,21.96 10.73,21.96 10.1,22.59 10.1,23.92 11.48,25.3 11.48,30.23 U7.11
PIN12: length 61.3
  Top Layer w0.254: v1(32.26,35.86) 33.22,36.83 33.22,37.73 U8.7 ; v1(7.62,34.21) 7.56,34.15 7.56,22.59 8.19,21.96 8.95,21.96 v1(9.65,21.26) ; v1(15.37,30.66) 12.32,30.66 v1(12.19,30.78) ; v1(12.45,17.7) v1(14.11,19.36)
  Bottom Layer w0.254: 13.72,15.42 13.9,15.6 13.9,16.25 v1(12.45,17.7) ; v1(14.11,19.36) 11.55,19.36 v1(9.65,21.26) ; v1(32.26,35.86) 20.26,35.86 15.37,30.97 v1(15.37,30.66) ; v1(12.19,30.78) 10.6,32.37 10.6,33.64 U7.12 9.02,34.21 v1(7.62,34.21)
$1N1454: length 35.7
  Top Layer w0.254: v1(32.51,41.07) 32.51,42.1 U8.5 ; v1(15.72,34.59) 15.55,34.77 15.38,34.77 14.96,35.19 14.96,37.44 14.59,37.82 12.53,37.82 10.55,39.8 U7.14
  Bottom Layer w0.254: v1(32.51,41.07) 22.2,41.07 v1(15.72,34.59)
$1N1740: length 20.1
  Top Layer w0.254: U7.9 9.91,26.72 v1(14.6,26.72) ; v1(19.81,19.61) 18.8,18.59 U5.14
  Bottom Layer w0.254: v1(14.6,26.72) 14.6,24.81 15.18,24.24 15.18,22.59 15.81,21.96 17.46,21.96 v1(19.81,19.61)
$1N3175: length 31.5
  Top Layer w0.254: U5-5R.1 v1(27.05,59.53) ; U5-5D.2 27.89,36.5 31.18,39.78 31.18,44.89 34.34,48.05 34.7,48.05 35.27,48.62 35.27,49.43 34.7,50.01 34.5,50.01 v1(27.05,57.45)
  Bottom Layer w0.254: v1(27.05,59.53) v1(27.05,57.45)
$1N3221: length 36.9
  Top Layer w0.254: v1(20.19,34.85) 20.19,43.94 19.81,44.32 v1(19.81,46.4) ; U5-4D.2 27.6,33.28 v1(26.29,34.59)
  Bottom Layer w0.254: v1(19.81,46.4) 20.95,47.55 20.95,49.96 28.57,57.58 U5-4R.1 ; v1(20.19,34.85) 26.03,34.85 v1(26.29,34.59)
$1N3267: length 26.6
  Top Layer w0.254: U5-3D.2 22.73,40.01 v1(22.73,42.09) ; v1(24.76,42.09) 24.76,42.17 26.99,44.39 28.46,44.39 v1(30.48,46.4) ; v1(29.97,59.61) 30.06,59.53 U5-3R.1
  Bottom Layer w0.254: v1(30.48,46.4) 30.23,46.66 30.23,59.36 v1(29.97,59.61) ; v1(24.76,42.09) v1(22.73,42.09)
$1N3313: length 29.8
  Top Layer w0.254: v1(31.37,46.15) 29.61,44.39 29.19,44.39 28.38,43.58 28.38,42.74 25.78,40.14 v1(25.78,38.28) ; U5-2D.2 22.73,36.58 v1(22.73,38.15)
  Bottom Layer w0.254: v1(22.73,38.15) 22.86,38.28 v1(25.78,38.28) ; U5-2R.1 34.29,50.41 31.37,47.49 v1(31.37,46.15)
$1N3359: length 27.4
  Top Layer w0.254: v1(16.64,30.15) 16.64,31.7 16.16,32.18 16.16,33.66 16.32,33.82 16.32,35.59 15.72,36.19 15.72,40.58 14.86,41.45 14.86,43.6 v1(14.16,44.3) ; v1(22.73,30.15) 22.65,30.23 U5-1D.2
  Bottom Layer w0.254: U5-1R.1 12.05,46.4 v1(14.16,44.3) ; v1(22.73,30.15) v1(16.64,30.15)
$1N7289: length 29.9
  Top Layer w0.254: v1(12.7,34.59) 11.98,33.88 U7-1D.2
  Bottom Layer w0.254: U7-1R.1 19.81,50.41 18.83,49.43 18.83,44.92 12.7,38.78 v1(12.7,34.59)
$1N7335: length 25
  Top Layer w0.254: v1(10.67,38.02) 11.98,36.71 U7-2D.2
  Bottom Layer w0.254: U7-2R.1 14.1,50.41 10.67,46.98 v1(10.67,38.02)
$1N7381: length 33.6
  Top Layer w0.254: U7-3D.2 16.94,34.38 v1(17.27,34.72) ; v1(13.59,40.69) 15.37,38.91 15.37,35.61 v1(15.62,35.36) ; v1(15.49,54.53) 15.49,54.79 11.18,59.1 U7-3R.1
  Bottom Layer w0.254: v1(15.62,35.36) 15.49,35.23 15.49,35.19 15.14,34.84 15.14,34.18 15.49,33.83 15.75,33.83 15.93,34.01 16.18,34.01 16.89,34.72 v1(17.27,34.72) ; v1(15.49,54.53) 15.49,44.88 14.74,44.13 14.74,43.69 13.59,42.53 v1(13.59,40.69)
$1N7427: length 33.1
  Top Layer w0.254: v1(14.48,38.4) 12.45,38.4 9.97,40.88 7.56,40.88 v1(6.86,41.58) ; v1(9.91,50.34) 9.91,57.75 U7-4R.1 ; U7-4D.2 16.93,38.23 v1(16.76,38.4)
  Bottom Layer w0.254: v1(6.86,41.58) 6.86,43.74 9.91,46.79 v1(9.91,50.34) ; v1(14.48,38.4) v1(16.76,38.4)
$1N7473: length 34.6
  Top Layer w0.254: v1(14.24,41.18) 13.25,42.17 11.73,42.17 10.82,41.26 9.08,41.26 8.51,41.83 7.75,41.83 v1(5.84,43.74) ; v1(15.49,42.82) 15.49,41.37 U7-5D.2
  Bottom Layer w0.254: v1(5.84,43.74) 9.11,47 9.11,49.43 5.84,52.7 5.84,58.89 U7-5R.1 ; v1(15.49,42.82) 15.49,42.44 v1(14.24,41.18)
$1N7519: length 29.1
  Top Layer w0.254: U7-6D.2 16.93,45.3 v1(17.27,45.64) ; U7-6R.1 2.29,56.53 10.77,48.05 11.58,48.05 13.75,50.21 v1(16.26,50.21)
  Bottom Layer w0.254: v1(17.27,45.64) 17.27,47.26 15.91,48.62 15.91,49.87 v1(16.26,50.21)
$1N7565: length 28
  Top Layer w0.254: 330Ω.1 22.8,25.6 22.8,20.47 20.26,17.93 20.26,14.97 20.89,14.34 21.78,14.34 22.41,14.97 22.41,19.08 25.7,22.36 green.2
$1N8990: length 27.7
  Top Layer w0.254: U5-6D.2 28.7,41.03 v1(28.7,41.71) ; v1(24.38,54.79) 28.7,50.47 v1(29.21,50.47) ; U5-6R.1 v1(24.26,59.53) ; 29.59,46.28 28.06,44.74 26.15,44.74 v1(26.03,44.63)
  Bottom Layer w0.254: v1(26.03,44.63) 26.03,44.37 v1(28.7,41.71) ; v1(24.38,54.79) 24.26,54.91 v1(24.26,59.53) ; v1(29.56,46.31) 29.56,50.12 v1(29.21,50.47)
$1N8994: length 33
  Top Layer w0.254: v1(27.69,50.34) 26.86,50.34 26.83,50.36 22.18,50.36 22.16,50.34 v1(18.41,50.34) ; v1(28.45,46.79) 26.87,45.21 25.79,45.21 25.02,44.44 v1(25.02,43.48) ; v1(25.53,41.96) 26.08,41.96 U5-7D.2
  Bottom Layer w0.254: v1(25.02,43.48) 25.53,42.98 v1(25.53,41.96) ; v1(28.45,46.79) 27.6,47.64 27.6,49.43 27.87,49.7 27.87,50.16 v1(27.69,50.34) ; v1(18.41,50.34) 18.41,58 U5-7R.1
$1N10884: length 41
  Top Layer w0.254: all-330Ω.1 35.57,47.38 34.18,47.38 31.53,44.73 31.53,28.7 21.34,18.5 U5.15
$1N10886: length 58.9
  Bottom Layer w0.254: v1(30.23,17.66) 35.35,22.78 38.48,22.78 38.73,22.53 38.73,19.67 40.02,18.39 40.5,18.39 41.14,19.03 41.14,46.49 37.21,50.41 all-330Ω.2
$1N10962: length 21.1
  Top Layer w0.254: U8.1 38.15,38.4 37.1,39.44 35.77,39.44 34.43,38.11 34.43,29.86 10kΩ.2
$1N10964: length 25.3
  Top Layer w0.254: 2.54,16.94 10.03,16.94 15.05,21.96 16.7,21.96 17.34,22.59 17.34,23.42 22.41,28.5 10kΩ.1
$1N11563: length 24
  Top Layer w0.254: U5.1 23.88,44.92 U5-1R.2
$1N11565: length 80.8
  Top Layer w0.254: U5-2R.2 32.64,47.38 21.99,47.38 21.42,46.81 21.42,29.72 15.18,23.48 15.18,22.59 10.46,17.87 1.57,17.87 1.41,17.71 1.41,16.17 1.57,16.01 3.51,16.01 4.08,16.58 10.31,16.58 15.33,21.6 18.89,21.6 20.32,23.04 U5.2
$1N11567: length 85.7
  Top Layer w0.254: U5-3R.2 30.08,47.74 21.84,47.74 21.06,46.96 21.06,31.91 12.64,23.48 12.64,22.59 8.27,18.23 1.43,18.23 1.05,17.85 1.05,16.03 2.75,14.34 14.16,14.34 14.79,14.97 14.79,15.99 20.76,21.96 21.78,21.96 22.41,22.59 22.41,23.48 21.78,24.12 19.88,24.12 U5.3
$1N11569: length 37.5
  Top Layer w0.254: U5-4R.2 28.75,48.85 28.75,48.59 28.1,48.59 26.69,50.01 22.33,50.01 17.86,45.54 17.86,29.84 v1(15.62,27.61)
  Bottom Layer w0.254: U5.4 15.62,23.67 v1(15.62,27.61)
$1N11571: length 31.1
  Bottom Layer w0.254: 13.72,23.04 13.97,23.29 13.97,34.53 25.07,45.63 25.07,47.83 25.83,48.59 25.83,48.85 U5-5R.2
$1N11573: length 30.8
  Bottom Layer w0.254: U5.6 13.46,25.32 13.46,38.86 22.73,48.13 U5-6R.2
$1N11575: length 45.1
  Top Layer w0.254: U5.7 8.45,23.23 8.45,37.71 2.35,43.8 0.99,43.8 0.83,43.96 0.83,45.8 1.35,46.32 10.49,46.32 11.57,45.24 13.1,45.24 U5-7R.2
$1N11659: length 20.5
  Top Layer w0.254: U7-1R.2 15.66,44.88 11.43,44.88 10.35,45.96 2.98,45.96 U7.1
$1N11661: length 19.1
  Top Layer w0.254: U7-2R.2 12.45,47.38 1.91,47.38 0.47,45.94 0.47,43.78 U7.2
$1N11663: length 155.4
  Top Layer w0.254: U7-3R.2 11.66,49.03 21.18,58.55 43.44,58.55 43.61,58.72 47.07,58.72 47.07,26.51 43.4,22.84 43.4,13.77 arc(43.2,13.72) 43.05,13.58 42.78,13.31 37.44,13.31 arc(37.31,13.61) 37.01,13.73 2.16,13.81 0.43,15.54 0.43,38.32 U7.3
$1N11665: length 14.3
  Bottom Layer w0.254: U7-4R.2 2.98,43.88 2.98,38.34 U7.4
$1N11667: length 16.5
  Top Layer w0.254: v1(3.24,45.07) v1(4.19,44.12)
  Bottom Layer w0.254: U7-5R.2 3.43,47.25 3.43,45.26 v1(3.24,45.07) ; v1(4.19,44.12) 4.19,37.01 U7.5
$1N11669: length 18
  Bottom Layer w0.254: U7.6 0.83,33.26 0.83,45.8 2.29,47.26 U7-6R.2
$1N11671: length 35
  Top Layer w0.254: v1(10.67,28.62) 11.3,29.26 v1(14.99,29.26)
  Bottom Layer w0.254: 330Ω.2 23.95,25.83 22.97,26.81 19.66,26.81 17.21,29.26 v1(14.99,29.26) ; U7.7 2.98,30.72 10.1,30.72 10.67,30.15 v1(10.67,28.62)
$1N13466: length 12
  Top Layer w0.254: X1.2 41.4,50.98 12pF.2 41.4,43.88 U8.2
$1N13478: length 13.4
  Top Layer w0.254: 12pF..2 44.2,53.78 X1.1 42.84,50.55 42.84,44.98 U8.3
$1N15286: length 18.3
  Top Layer w0.254: 41.65,21.25 38.64,24.26 U9.4 38.16,25.39 4.7uF.1 100nF..1 ; 41.65,21.25 USB1.A9 ; 41.65,21.25 41.03,21.25 40.26,22.02 v1(40.26,22.4) ; v1(40.26,18.97) 40.63,18.61 41.43,18.61 USB1.B9
  Bottom Layer w0.254: v1(40.26,18.97) 40.26,20.43 40.34,20.51 40.34,22.33 v1(40.26,22.4)
$1N15518: length 33.2
  Top Layer w0.254: v1(14.99,28.5) 11.68,28.5 v1(10.79,27.61) ; v1(16.44,25.76) 17.91,27.23 v1(17.91,27.74) ; v1(28.07,24.18) 36.18,24.18 U9.5
  Bottom Layer w0.254: v1(17.91,27.74) 17.14,28.5 v1(14.99,28.5) ; v1(10.79,27.61) 10.79,26 R40.1 ; v1(16.44,25.76) 16.38,25.7 16.38,25.45 17.65,24.18 v1(28.07,24.18)
$1N16011: length 18.8
  Top Layer w0.254: 5.1.kΩ.1 32.51,29.33 32.08,28.9 32.08,28.09 32.66,27.52 34.47,27.52 37.58,24.41 37.58,23.65 37.75,23.48 38.24,23.48 41.1,20.63 41.43,20.63 USB1.B5
$1N16013: length 43.2
  Top Layer w0.254: v1(39.75,20.75) 40.9,19.61 41.45,19.61 USB1.A5
  Bottom Layer w0.254: 5.1kΩ.1 24.67,46.99 24.67,49.43 25.25,50.01 26.06,50.01 26.63,49.43 26.63,47.77 33.1,41.31 33.1,40.03 35.73,37.4 35.73,34.85 40.47,30.1 40.47,25.03 39.67,24.23 39.67,20.83 v1(39.75,20.75)

## Text on the board
Top Silkscreen Layer: www.tengy.org | @i.matsudzu | @tengy_ez | + | - | ≽^•⩊•^≼
